# Altium schematic sheet Driver.SchDoc
size B; SheetNumber: 4; SheetTotal: 15
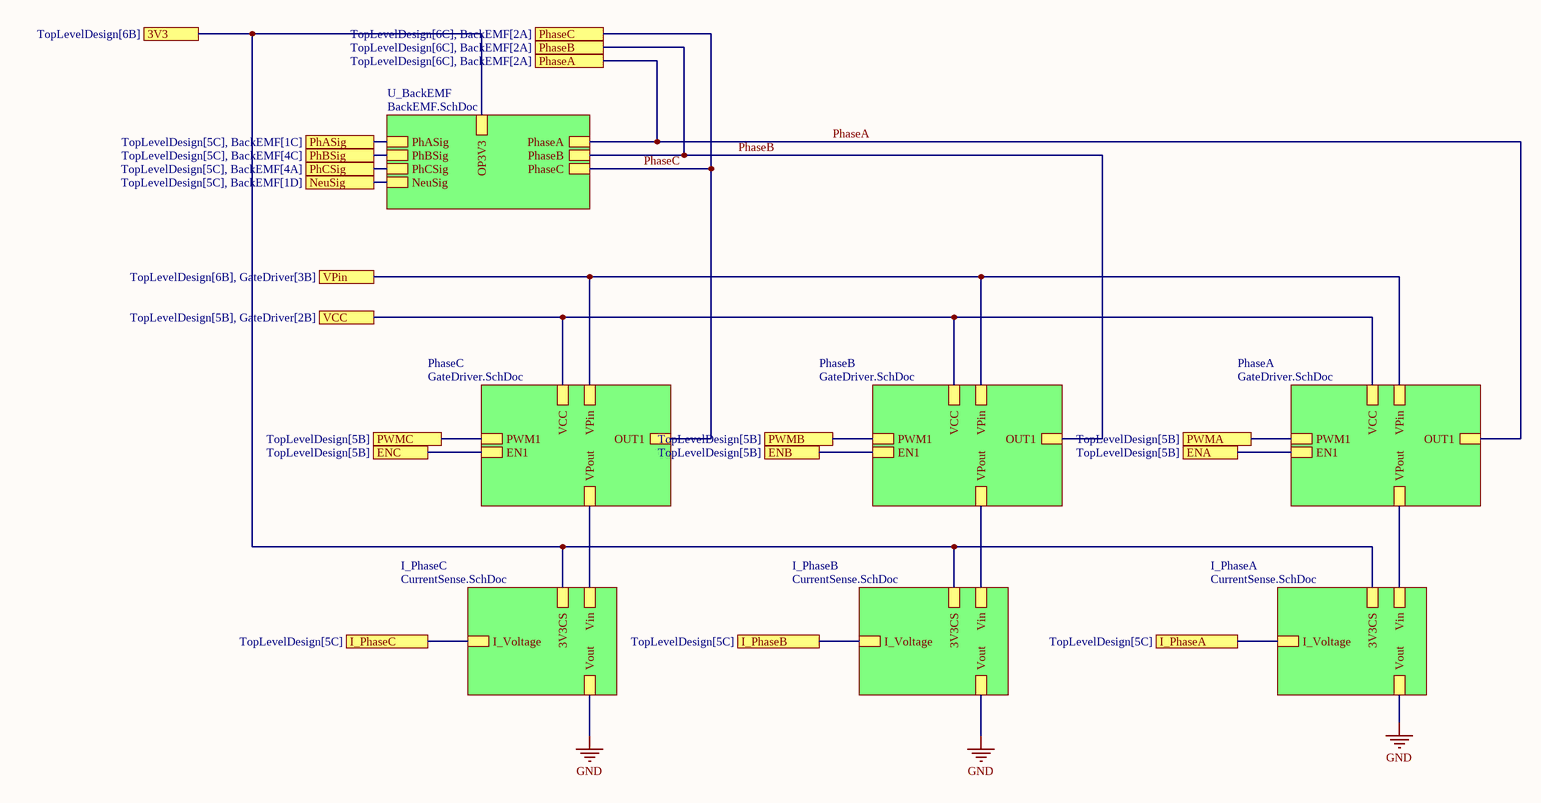
[diagram p0: Driver.SchDoc]

## Sub-sheets
I_PhaseA = CurrentSense.SchDoc: Vout, Vin, I_Voltage, 3V3CS
I_PhaseB = CurrentSense.SchDoc: Vout, Vin, I_Voltage, 3V3CS
I_PhaseC = CurrentSense.SchDoc: Vout, Vin, I_Voltage, 3V3CS
PhaseA = GateDriver.SchDoc: PWM1, OUT1, EN1, VPin, VCC, VPout
PhaseB = GateDriver.SchDoc: PWM1, OUT1, EN1, VPin, VCC, VPout
PhaseC = GateDriver.SchDoc: PWM1, OUT1, EN1, VPin, VCC, VPout
U_BackEMF = BackEMF.SchDoc: PhaseA, PhaseB, PhaseC, PhCSig, PhBSig, PhASig, NeuSig, OP3V3

## Ports
3V3 (see TopLevelDesign[6B]), ENA (see TopLevelDesign[5B]), ENB (see TopLevelDesign[5B]), ENC (see TopLevelDesign[5B]), I_PhaseA (see TopLevelDesign[5C]), I_PhaseB (see TopLevelDesign[5C]), I_PhaseC (see TopLevelDesign[5C]), NeuSig (see TopLevelDesign[5C], BackEMF[1D]), PhaseA (see TopLevelDesign[6C], BackEMF[2A]), PhaseB (see TopLevelDesign[6C], BackEMF[2A]), PhaseC (see TopLevelDesign[6C], BackEMF[2A]), PhASig (see TopLevelDesign[5C], BackEMF[1C]), PhBSig (see TopLevelDesign[5C], BackEMF[4C]), PhCSig (see TopLevelDesign[5C], BackEMF[4A]), PWMA (see TopLevelDesign[5B]), PWMB (see TopLevelDesign[5B]), PWMC (see TopLevelDesign[5B]), VCC (see TopLevelDesign[5B], GateDriver[2B]), VPin (see TopLevelDesign[6B], GateDriver[3B])

## Nets
GND: sheet I_PhaseB/Vout, sheet I_PhaseC/Vout, sheet I_PhaseA/Vout
3V3: port 3V3, sheet I_PhaseB/3V3CS, sheet I_PhaseC/3V3CS, sheet I_PhaseA/3V3CS, sheet U_BackEMF/OP3V3
ENA: port ENA, sheet PhaseA/EN1
ENB: port ENB, sheet PhaseB/EN1
ENC: port ENC, sheet PhaseC/EN1
I_PhaseA: port I_PhaseA, sheet I_PhaseA/I_Voltage
I_PhaseB: port I_PhaseB, sheet I_PhaseB/I_Voltage
I_PhaseC: port I_PhaseC, sheet I_PhaseC/I_Voltage
NeuSig: port NeuSig, sheet U_BackEMF/NeuSig
PhaseA: port PhaseA, sheet U_BackEMF/PhaseA, sheet PhaseA/OUT1
PhaseB: port PhaseB, sheet U_BackEMF/PhaseB, sheet PhaseB/OUT1
PhaseC: port PhaseC, sheet U_BackEMF/PhaseC, sheet PhaseC/OUT1
PhASig: port PhASig, sheet U_BackEMF/PhASig
PhBSig: port PhBSig, sheet U_BackEMF/PhBSig
PhCSig: port PhCSig, sheet U_BackEMF/PhCSig
PWMA: port PWMA, sheet PhaseA/PWM1
PWMB: port PWMB, sheet PhaseB/PWM1
PWMC: port PWMC, sheet PhaseC/PWM1
VCC: port VCC, sheet PhaseB/VCC, sheet PhaseC/VCC, sheet PhaseA/VCC
VPin: port VPin, sheet PhaseB/VPin, sheet PhaseC/VPin, sheet PhaseA/VPin
(unnamed): sheet I_PhaseB/Vin, sheet PhaseB/VPout
(unnamed): sheet I_PhaseC/Vin, sheet PhaseC/VPout
(unnamed): sheet I_PhaseA/Vin, sheet PhaseA/VPout